# EAGLE design PowerManagementBoard (EAGLE 6.1)
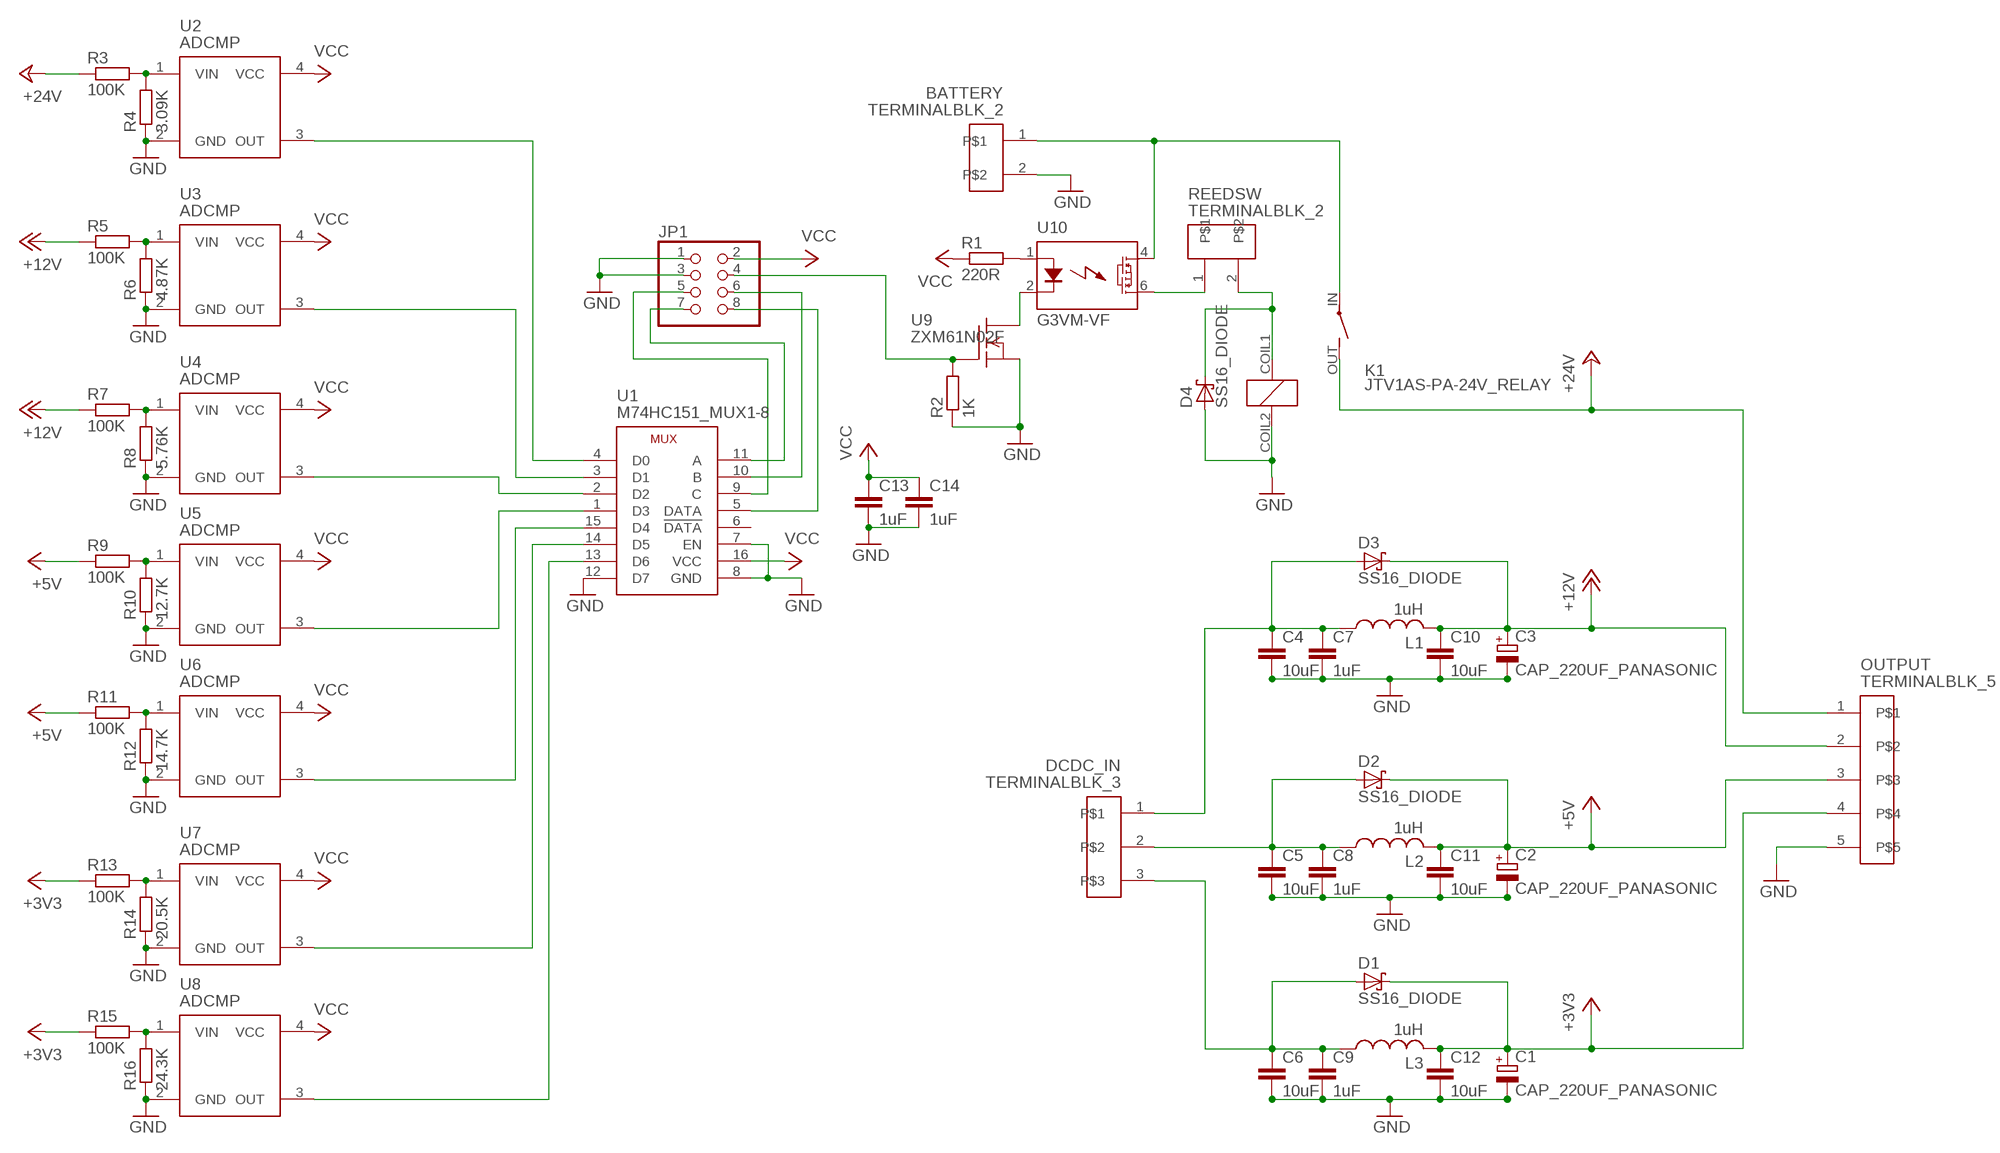
[diagram p0: schematic, sheet 1]

## Parts
BATTERY  TERMINALBLK_2  [TERMINAL_BLK-2]
C1  CAP_220UF_PANASONIC  [CAP_220UF_PANASONIC]
C2  CAP_220UF_PANASONIC  [CAP_220UF_PANASONIC]
C3  CAP_220UF_PANASONIC  [CAP_220UF_PANASONIC]
C4  10uF  C-EUC1206  [C1206]
C5  10uF  C-EUC1206  [C1206]
C6  10uF  C-EUC1206  [C1206]
C7  1uF  C-EUC1206  [C1206]
C8  1uF  C-EUC1206  [C1206]
C9  1uF  C-EUC1206  [C1206]
C10  10uF  C-EUC1206  [C1206]
C11  10uF  C-EUC1206  [C1206]
C12  10uF  C-EUC1206  [C1206]
C13  1uF  C-EUC1206  [C1206]
C14  1uF  C-EUC1206  [C1206]
D1  SS16_DIODE  [DO214AC]
D2  SS16_DIODE  [DO214AC]
D3  SS16_DIODE  [DO214AC]
D4  SS16_DIODE  [DO214AC]
DCDC_IN  TERMINALBLK_3  [TERMINAL_BLK-3]
JP1  PINHD-2X4  [2X04]
K1  JTV1AS-PA-24V_RELAY  [JTV-RELAY_FORM1A]
L1  1uH  CHOKE_1UH_WE-HCC_8070  [CHOKE_WE-HCC_8070]
L2  1uH  CHOKE_1UH_WE-HCC_8070  [CHOKE_WE-HCC_8070]
L3  1uH  CHOKE_1UH_WE-HCC_8070  [CHOKE_WE-HCC_8070]
OUTPUT  TERMINALBLK_5  [TERMINAL_BLK-5]
R1  220R  R-EU_R0603  [R0603]
R2  1K  R-EU_R0603  [R0603]
R3  100K  R-EU_R0603  [R0603]
R4  3.09K  R-EU_R0603  [R0603]
R5  100K  R-EU_R0603  [R0603]
R6  4.87K  R-EU_R0603  [R0603]
R7  100K  R-EU_R0603  [R0603]
R8  5.76K  R-EU_R0603  [R0603]
R9  100K  R-EU_R0603  [R0603]
R10  12.7K  R-EU_R0603  [R0603]
R11  100K  R-EU_R0603  [R0603]
R12  14.7K  R-EU_R0603  [R0603]
R13  100K  R-EU_R0603  [R0603]
R14  20.5K  R-EU_R0603  [R0603]
R15  100K  R-EU_R0603  [R0603]
R16  24.3K  R-EU_R0603  [R0603]
REEDSW  TERMINALBLK_2  [TERMINAL_BLK-2]
U1  M74HC151_MUX1-8  [TSSOP16]
U2  ADCMP  [SC70-4]
U3  ADCMP  [SC70-4]
U4  ADCMP  [SC70-4]
U5  ADCMP  [SC70-4]
U6  ADCMP  [SC70-4]
U7  ADCMP  [SC70-4]
U8  ADCMP  [SC70-4]
U9  ZXM61N02F  [SOT23W]
U10  G3VM-VF  [G3VM-VF]

## Nets
+3V3: C1.P(+) C12.1 D1.C L3.P$2 OUTPUT.4 R13.1 R15.1
+5V: C2.P(+) C11.1 D2.C L2.P$2 OUTPUT.3 R9.1 R11.1
+12V: C3.P(+) C10.1 D3.C L1.P$2 OUTPUT.2 R5.1 R7.1
+24V: K1.OUT(2:S) OUTPUT.1 R3.1
GND: BATTERY.2 C1.N(-) C2.N(-) C3.N(-) C4.2 C5.2 C6.2 C7.2 C8.2 C9.2 C10.2 C11.2 C12.2 C13.2 C14.2 D4.A JP1.1 JP1.3 K1.COIL2 OUTPUT.5 R2.1 R4.1 R6.1 R8.1 R10.1 R12.1 R14.1 R16.1 U1.7(EN) U1.8(GND) U1.12(D7) U2.2(GND) U3.2(GND) U4.2(GND) U5.2(GND) U6.2(GND) U7.2(GND) U8.2(GND) U9.2(S)
N$1: BATTERY.1 K1.IN(2:P) U10.4(DS1)
N$2: REEDSW.1 U10.6(DS2)
N$3: D4.C K1.COIL1 REEDSW.2
N$4: C6.1 C9.1 D1.A DCDC_IN.3 L3.P$1
N$5: C5.1 C8.1 D2.A DCDC_IN.2 L2.P$1
N$6: C4.1 C7.1 D3.A DCDC_IN.1 L1.P$1
N$7: U9.3(D) U10.2(K)
N$8: R1.2 U10.1(A)
N$9: JP1.4 R2.2 U9.1(G)
N$10: JP1.8 U1.5(DATA)
N$11: JP1.6 U1.10(B)
N$12: JP1.7 U1.11(A)
N$13: JP1.5 U1.9(C)
N$14: R3.2 R4.2 U2.1(VIN)
N$15: R5.2 R6.2 U3.1(VIN)
N$16: R7.2 R8.2 U4.1(VIN)
N$17: R9.2 R10.2 U5.1(VIN)
N$18: R11.2 R12.2 U6.1(VIN)
N$19: R13.2 R14.2 U7.1(VIN)
N$20: R15.2 R16.2 U8.1(VIN)
N$21: U1.4(D0) U2.3(OUT)
N$22: U1.3(D1) U3.3(OUT)
N$23: U1.2(D2) U4.3(OUT)
N$24: U1.1(D3) U5.3(OUT)
N$25: U1.15(D4) U6.3(OUT)
N$26: U1.14(D5) U7.3(OUT)
N$27: U1.13(D6) U8.3(OUT)
VCC: C13.1 C14.1 JP1.2 R1.1 U1.16(VCC) U2.4(VCC) U3.4(VCC) U4.4(VCC) U5.4(VCC) U6.4(VCC) U7.4(VCC) U8.4(VCC)
Unconnected: U1.6(!DATA)

## Library data of the parts
BATTERY REEDSW = PowerManagementBoard:TERMINALBLK_2
C1-C3 = PowerManagementBoard:CAP_220UF_PANASONIC
C4-C14 = rcl:C-EU: CAPACITOR, European symbol
D1-D4 = PowerManagementBoard:SS16_DIODE: SS16 (Fairchild Semiconductor) 1.0A Schottky Barrier Diode
DCDC_IN = PowerManagementBoard:TERMINALBLK_3
JP1 = PowerManagementBoard:PINHD-2X4: PIN HEADER
K1 = PowerManagementBoard:JTV1AS-PA-24V_RELAY: Power Relay SCHRACK 1 pole 30 A Source: http://www.schrack.com/.. 5848.pdf
L1-L3 = PowerManagementBoard:CHOKE_1UH_WE-HCC_8070: 1uH Inductor (Wurth Electronics Inc). Shielded SMT, 17A
OUTPUT = PowerManagementBoard:TERMINALBLK_5
R1-R16 = rcl:R-EU_: RESISTOR, European symbol
U1 = PowerManagementBoard:M74HC151_MUX1-8
U2-U8 = PowerManagementBoard:ADCMP: ADCMP356 (Analog Devices) Comparator with 0.6V reference (active high, push-pull)
U9 = PowerManagementBoard:ZXM61N02F: N-Ch Enhancement MOSFET, Logic Level (SOT23)
U10 = PowerManagementBoard:G3VM-VF

## Board
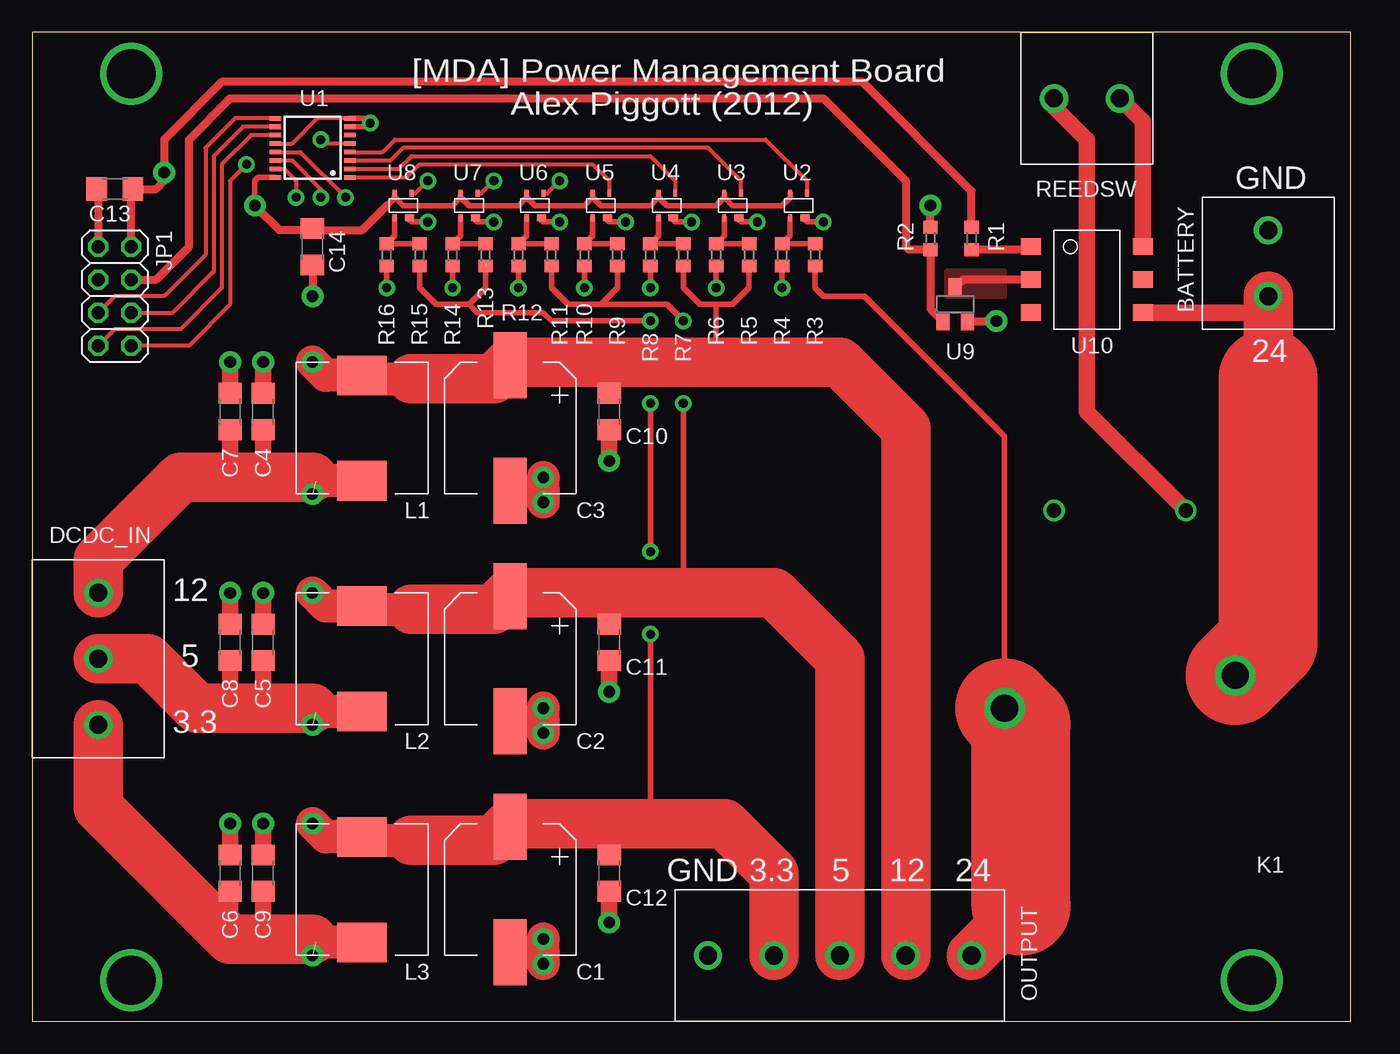
[diagram p1: board, top side]
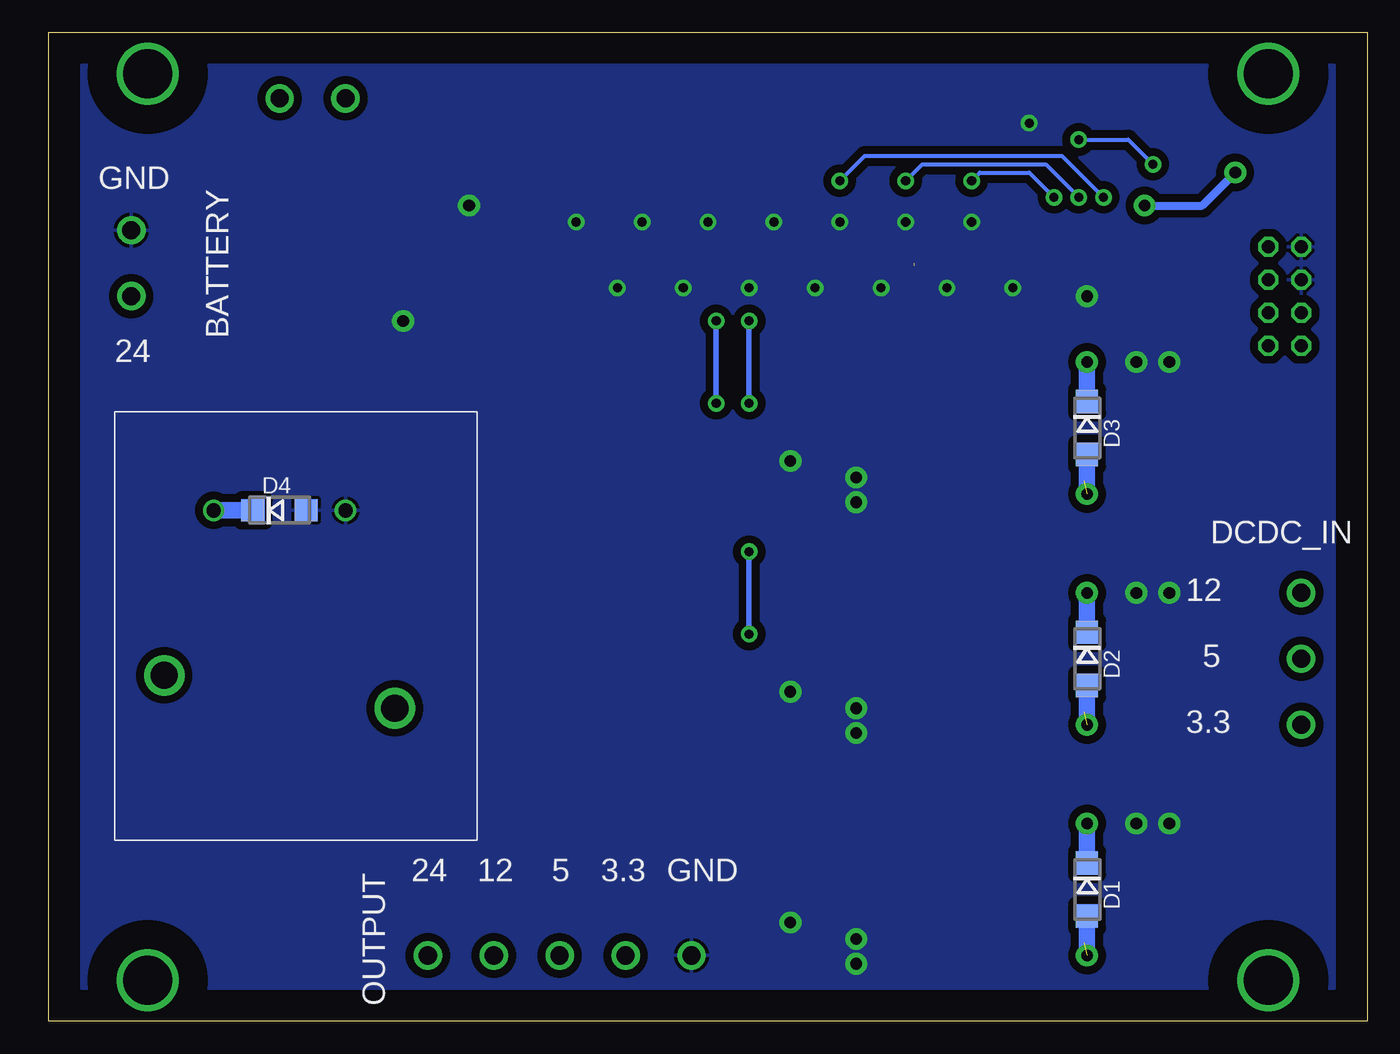
[diagram p2: board, bottom side, seen from below]

Size 101.6 x 76.2 mm. Coordinates in mm from the lower left corner, seen from the top.
Outline: 0,0 101.6,0 101.6,76.2 0,76.2 0,0
Copper layers (1*16): Top 0.035mm / dielectric 1.5mm / Bottom 0.035mm
Design rules: minimum track width 10mil, minimum drill 24mil, track to track 10mil, track to pad 10mil, pad to pad 10mil, via to via 10mil, smd to smd 8mil, copper to edge 40mil, drill to drill 8mil, minimum pad ring 10mil, minimum via ring 8mil, stop-mask expansion 4mil, vias tented up to drill 0mil, thermal gap 10mil
bRestrict: area 3.8,-0.6 to 11.4,7; area 3.8,69.2 to 11.4,76.8; area 90.2,-0.6 to 97.8,7; area 90.2,69.2 to 97.8,76.8

### Footprints (pad centres in the part's own frame; a part is rotated, then mirrored left to right if it is on the bottom)
TERMINAL_BLK-2 = drill 1.397 pad 2.184: 1 0,0; 2 5.08,0
CAP_220UF_PANASONIC = smd 5.08 x 2.54: N 4.826,0; P -4.826,0
C1206 = smd 1.6 x 1.8: 1 -1.4,0; 2 1.4,0
DO214AC = smd 1.8 x 1.7: A 2.05,0; C -2.05,0
TERMINAL_BLK-3 = drill 1.397 pad 2.184: 1 0,0; 2 5.08,0; 3 10.16,0
2X04 = drill 1.016 octagon: 1 -3.81,-1.27; 2 -3.81,1.27; 3 -1.27,-1.27; 4 -1.27,1.27; 5 1.27,-1.27; 6 1.27,1.27; 7 3.81,-1.27; 8 3.81,1.27
JTV-RELAY_FORM1A = drill 1.092: COIL1 -5.08,-8.89; COIL2 5.08,-8.89 | drill 2.108: IN -8.89,3.81; OUT 8.89,6.35
CHOKE_WE-HCC_8070 = smd 3.048 x 3.81: P$1 4.064,0; P$2 -4.064,0
TERMINAL_BLK-5 = drill 1.397 pad 2.184: 1 0,0; 2 5.08,0; 3 10.16,0; 4 15.24,0; 5 20.32,0
R0603 = smd 1 x 1.1: 1 -0.85,0; 2 0.85,0
TSSOP16 = smd 0.9 x 0.35: 1 -2.875,2.275; 2 -2.875,1.625; 3 -2.875,0.975; 4 -2.875,0.325; 5 -2.875,-0.325; 6 -2.875,-0.975; 7 -2.875,-1.625; 8 -2.875,-2.275; 9 2.875,-2.275; 10 2.875,-1.625; 11 2.875,-0.975; 12 2.875,-0.325; 13 2.875,0.325; 14 2.875,0.975; 15 2.875,1.625; 16 2.875,2.275
SC70-4 = smd 0.3 x 0.525: 1 -0.65,-0.938; 3 0.65,0.938; 4 -0.65,0.938 | smd 0.7 x 0.525: 2 0.5,-0.938
SOT23W = smd 1 x 1.4: 1 -0.95,-1.303; 2 0.95,-1.303; 3 0,1.303
G3VM-VF = smd 1.27 x 1.524: 1 -2.54,-4.318; 2 0,-4.318; 3 2.54,-4.318; 4 2.54,4.318; 5 0,4.318; 6 -2.54,4.318

### Placement (x,y rotation side)
BATTERY  95.25,55.88 90 top
C1  36.83,10.16 270 top
C2  36.83,27.94 270 top
C3  36.83,45.72 270 top
C4  17.78,46.99 90 top
C5  17.78,29.21 90 top
C6  15.24,11.43 90 top
C7  15.24,46.99 90 top
C8  15.24,29.21 90 top
C9  17.78,11.43 90 top
C10  44.45,46.99 270 top
C11  44.45,29.21 270 top
C12  44.45,11.43 270 top
C13  6.35,64.14 180 top
C14  21.59,59.69 270 top
D1  21.59,10.16 270 bottom
D2  21.59,27.94 270 bottom
D3  21.59,45.72 270 bottom
D4  83.82,39.37 0 bottom
DCDC_IN  5.08,33.02 270 top
JP1  6.35,55.88 270 top
K1  83.82,30.48 180 top
L1  25.4,45.72 270 top
L2  25.4,27.94 270 top
L3  25.4,10.16 270 top
OUTPUT  72.39,5.08 180 top
R1  72.39,60.33 270 top
R2  69.22,60.33 270 top
R3  60.33,59.05 90 top
R4  57.78,59.05 90 top
R5  55.24,59.05 90 top
R6  52.7,59.05 90 top
R7  50.16,59.05 90 top
R8  47.62,59.05 90 top
R9  45.09,59.05 90 top
R10  42.55,59.05 90 top
R11  40.01,59.05 90 top
R12  37.47,59.05 90 top
R13  34.92,59.05 90 top
R14  32.38,59.05 90 top
R15  29.84,59.05 90 top
R16  27.3,59.05 90 top
REEDSW  83.82,71.12 180 top
U1  21.59,67.31 180 top
U2  59.05,62.87 0 top
U3  53.98,62.87 0 top
U4  48.9,62.87 0 top
U5  43.81,62.87 0 top
U6  38.73,62.87 0 top
U7  33.66,62.87 0 top
U8  28.57,62.87 0 top
U9  71.12,55.24 0 top
U10  81.28,57.15 270 top

### Tracks (layer width: path | path; a pad name or v marks a point on that pad's centre or on a via)
+3V3  (via drill 0.7 pad 1.27, 0.9 pad 1.68)  (1 unrouted)
  Top 0.406: R15.1 29.84,56.52 31.11,55.24 33.66,55.24 | 33.66,55.24 34.92,56.52 34.92,58.42 | 33.66,55.24 34.29,54.61 39.37,54.61 40.01,53.98 v47.62,53.98 | v47.62,47.62 v47.62,36.2 | v47.62,29.84 47.62,15.24
  Top 1.27: C12.1 44.45,15.24
  Top 2.54: C1.P 36.58,14.99 | 36.58,14.99 35.56,13.97 | 29.21,13.97 26.67,13.97 26.42,14.22 L3.P$2 22.61,14.22 v21.59,15.24 | 34.29,13.97 33.02,13.97 | 36.58,14.99 36.83,15.24
  Top 3.81: 29.21,13.97 34.29,13.97 35.56,13.97 36.83,15.24 44.45,15.24 47.62,15.24 53.34,15.24 57.15,11.43 OUTPUT.4
  Bottom 0.406: v47.62,53.98 v47.62,47.62 | v47.62,36.2 v47.62,29.84
  Bottom 1.27: D1.C v21.59,15.24
+5V  (via drill 0.7 pad 1.27, 0.9 pad 1.68)
  Top 0.406: R11.1 40.01,56.52 41.27,55.24 43.81,55.24 | 43.81,55.24 45.09,56.52 R9.1 | 43.81,55.24 48.9,55.24 v50.16,53.98 | v50.16,47.62 50.16,33.02
  Top 1.27: C11.1 44.45,33.02
  Top 2.54: 35.56,31.75 36.58,32.77 C2.P 36.83,33.02 | 29.21,31.75 26.67,31.75 26.42,32 L2.P$2 22.61,32 v21.59,33.02 | 34.29,31.75 33.02,31.75
  Top 3.81: 29.21,31.75 34.29,31.75 35.56,31.75 36.83,33.02 44.45,33.02 50.16,33.02 57.15,33.02 62.23,27.94 OUTPUT.3
  Bottom 0.406: v50.16,53.98 v50.16,47.62
  Bottom 1.27: D2.C v21.59,33.02
+12V  (via drill 0.9 pad 1.68)
  Top 0.406: R7.1 50.16,56.52 51.44,55.24 52.7,55.24 | R5.1 55.24,56.52 53.98,55.24 52.7,55.24 | 52.7,55.24 52.7,51.44 53.34,50.8
  Top 1.27: C10.1 44.45,50.8
  Top 2.54: 35.56,49.53 36.58,50.55 C3.P 36.83,50.8 | 29.21,49.53 26.67,49.53 26.42,49.78 L1.P$2 22.61,49.78 v21.59,50.8 | 34.29,49.53 33.02,49.53
  Top 3.81: OUTPUT.2 67.31,45.72 62.23,50.8 53.34,50.8 44.45,50.8 36.83,50.8 35.56,49.53 34.29,49.53 29.21,49.53
  Bottom 1.27: D3.C v21.59,50.8
+24V
  Top 0.406: R3.1 60.33,56.52 60.96,55.88 64.14,55.88 74.93,45.09 K1.OUT
  Top 3.81: OUTPUT.1 76.2,8.89
  Top 7.62: 76.2,8.89 76.2,22.86 K1.OUT
GND  (via drill 0.7 pad 1.27, 0.9 pad 1.68)
  Top 0.305: U1.8 21.96,69.58 20.01,67.64 U1.12
  Top 0.406: R16.1 v27.3,56.52 | R14.1 v32.38,56.52 | R12.1 v37.47,56.52 | R10.1 v42.55,56.52 | R8.1 v47.62,56.52 | R6.1 v52.7,56.52 | R4.1 v57.78,56.52 | U8.2 29.07,61.73 29.21,61.59 v30.48,61.59 | U7.2 34.16,61.73 34.29,61.59 v35.56,61.59 | U6.2 39.23,61.73 39.37,61.59 v40.64,61.59 | U5.2 44.31,61.73 44.45,61.59 v45.72,61.59 | U4.2 49.4,61.73 49.53,61.59 v50.8,61.59 | U3.2 54.48,61.73 54.61,61.59 v55.88,61.59 | U2.2 59.55,61.73 59.69,61.59 v60.96,61.59 | U1.7 25.75,68.94 v26.04,69.22 25.66,69.58 U1.8
  Top 0.61: C14.2 v21.59,55.88 | R2.1 v69.22,62.87 | U9.2 73.42,53.94 73.43,53.95 74.27,53.95 v74.3,53.98 | C13.2 5.08,64.14 JP1.1
  Top 1.27: C7.2 v15.24,50.8 | C4.2 v17.78,50.8 | C8.2 v15.24,33.02 | C5.2 v17.78,33.02 | C10.2 v44.45,43.18 | C11.2 v44.45,25.4 | C12.2 v44.45,7.62 | C6.2 v15.24,15.24 | C9.2 v17.78,15.24
  Top 2.54: C3.N 39.37,40.89 | 39.37,40.89 v39.37,41.91 | 39.37,40.89 v39.37,40.01 | C2.N 39.37,23.11 | 39.37,23.11 v39.37,24.13 | 39.37,23.11 v39.37,22.23 | C1.N 39.37,5.33 | 39.37,5.33 v39.37,6.35 | 39.37,5.33 v39.37,4.45
  pour Bottom (isolate 0.61): 2.54,73.66 2.54,2.54 99.06,2.54 99.06,73.66
N$1
  Top 1.27: U10.4 93.98,54.61 BATTERY.1 95.25,46.35
  Top 3.81: BATTERY.1 95.25,50.8
  Top 7.62: K1.IN 95.25,29.21 95.25,46.35 95.25,49.53
N$2
  Top 1.27: U10.6 85.6,69.34 REEDSW.1
N$3
  Top 1.27: REEDSW.2 78.74,70.48 81.28,67.94 81.28,46.99 K1.COIL1
  Bottom 1.27: D4.C K1.COIL1
N$4  (via drill 0.9 pad 1.68)  (1 unrouted)
  Top 1.27: C6.1 15.24,6.35 | C9.1 17.78,6.35
  Top 2.54: L3.P$1 21.84,6.1 21.59,6.35
  Top 3.81: DCDC_IN.3 5.08,16.51 15.24,6.35 17.78,6.35 21.59,6.35
  Bottom 1.27: D1.A v21.59,5.08
N$5  (via drill 0.9 pad 1.68)  (1 unrouted)
  Top 1.27: C8.1 15.24,24.13 | C5.1 17.78,24.13
  Top 2.54: L2.P$1 21.84,23.88 21.59,24.13
  Top 3.81: DCDC_IN.2 8.89,27.94 12.7,24.13 15.24,24.13 17.78,24.13 21.59,24.13
  Bottom 1.27: D2.A v21.59,22.86
N$6  (via drill 0.9 pad 1.68)  (1 unrouted)
  Top 1.27: C7.1 15.24,41.91 | C4.1 17.78,41.91
  Top 2.54: L1.P$1 21.84,41.66 21.59,41.91
  Top 3.81: DCDC_IN.1 5.08,35.56 11.43,41.91 15.24,41.91 17.78,41.91 21.59,41.91
  Bottom 1.27: D3.A v21.59,40.64
N$7
  Top 0.61: U10.2 71.72,57.15 U9.3
  pour Top (no thermals): 70.48,57.78 74.93,57.78 74.93,55.88 70.48,55.88
N$8
  Top 0.61: U10.1 76.75,59.48 R1.2
N$9
  Top 0.61: JP1.4 9.53,57.15 12.06,59.69 12.06,67.94 15.24,71.12 60.96,71.12 67.31,64.77 67.31,59.69 67.53,59.48 R2.2 69.22,54.9 U9.1
N$10  (via drill 0.7 pad 1.27)
  Top 0.305: U1.5 22.54,67.64 v22.23,67.94 | v16.51,66.04 15.24,64.77 15.24,55.24 12.06,52.07 JP1.8
  Bottom 0.305: v22.23,67.94 18.41,67.94 v16.51,66.04
N$11
  Top 0.305: U1.10 16.23,68.94 13.97,66.67 13.97,57.78 10.79,54.61 JP1.6
N$12
  Top 0.305: U1.11 16.85,68.28 14.61,66.04 14.61,56.52 11.43,53.34 6.35,53.34 JP1.7
N$13
  Top 0.305: U1.9 15.61,69.58 13.34,67.31 13.34,59.05 10.16,55.88 6.35,55.88 JP1.5 5.71,55.24
N$14
  Top 0.406: U2.1 58.41,60.52 R4.2 R3.2
N$15
  Top 0.406: U3.1 53.33,60.52 R6.2 R5.2
N$16
  Top 0.406: U4.1 48.24,60.52 R8.2 R7.2
N$17
  Top 0.406: U5.1 43.16,60.52 R10.2 R9.2
N$18
  Top 0.406: U6.1 38.09,60.52 R12.2 R11.2
N$19
  Top 0.406: U7.1 33.01,60.52 R14.2 R13.2
N$20
  Top 0.406: U8.1 27.93,60.52 R16.2 R15.2
N$21
  Top 0.305: U1.4 26.98,66.98 27.94,67.94 56.52,67.94 59.69,64.77 59.69,63.82 U2.3
N$22
  Top 0.305: U3.3 54.62,64.75 52.07,67.31 28.57,67.31 27.6,66.33 U1.3
N$23
  Top 0.305: U1.2 28.22,65.69 29.21,66.67 47.62,66.67 49.53,64.77 49.53,63.82 U4.3
N$24
  Top 0.305: U1.1 28.84,65.03 29.84,66.04 43.18,66.04 44.47,64.75 U5.3
N$25  (via drill 0.7 pad 1.27)
  Top 0.305: U1.15 19.41,65.69 20.32,64.77 v20.32,63.5 | U6.3 39.67,63.8 v40.64,64.77
  Bottom 0.305: v20.32,63.5 23.5,66.67 38.73,66.67 v40.64,64.77
N$26  (via drill 0.7 pad 1.27)
  Top 0.305: U1.14 20.02,66.33 22.23,64.14 v22.23,63.5 | U7.3 34.59,63.8 v35.56,64.77
  Bottom 0.305: v35.56,64.77 34.29,66.04 24.77,66.04 v22.23,63.5
N$27  (via drill 0.7 pad 1.27)
  Top 0.305: U1.13 20.64,66.98 v24.13,63.5 | U8.3 29.51,63.8 v30.48,64.77
  Bottom 0.305: v30.48,64.77 29.84,65.41 26.04,65.41 v24.13,63.5
N$28  (via drill 3.76)
  other vias: 7.62,3.17
N$29  (via drill 3.76)
  other vias: 7.62,73.03
N$30  (via drill 3.76)
  other vias: 93.98,73.03
N$31  (via drill 3.76)
  other vias: 93.98,3.17
VCC  (via drill 0.9 pad 1.68)
  Top 0.406: U8.4 27.93,63.52 27.94,63.5 | 27.94,63.5 28.57,62.87 32.38,62.87 33.02,63.5 33.02,63.79 U7.4 33.01,63.52 33.66,62.87 37.47,62.87 38.1,63.5 38.1,63.79 U6.4 38.09,63.52 38.73,62.87 42.55,62.87 43.18,63.5 43.18,63.79 U5.4 43.16,63.52 43.81,62.87 47.62,62.87 48.26,63.5 48.26,63.79 U4.4 48.24,63.52 48.9,62.87 52.7,62.87 53.34,63.5 53.34,63.79 U3.4 53.33,63.52 53.98,62.87 57.78,62.87 58.42,63.5 58.42,63.79 U2.4 | 27.3,62.87 27.94,63.5 | U1.16 17.41,65.03 17.14,64.77 v17.14,62.87
  Top 0.61: JP1.2 7.62,64.14 C13.1 9.53,64.14 10.16,64.77 v10.16,65.41 10.16,67.94 14.61,72.39 63.98,72.39 72.39,63.98 R1.1 | v17.14,62.87 19.05,60.96 21.59,60.96 | 21.59,60.96 25.4,60.96 27.3,62.87 | C14.1 21.59,60.96
  Top 1.27: 7.62,64 C13.1
  Bottom 0.61: v17.14,62.87 12.7,62.87 v10.16,65.41

### Text on the board
tNames: [MDA] Power Management Board | Alex Piggott (2012) | GND | 24 | 12 | 5 | 3.3 | GND | 3.3 | 5 | 12 | 24
bNames: BATTERY | GND | 24 | DCDC_IN | 12 | 5 | 3.3 | GND | 3.3 | 5 | 12 | 24 | OUTPUT